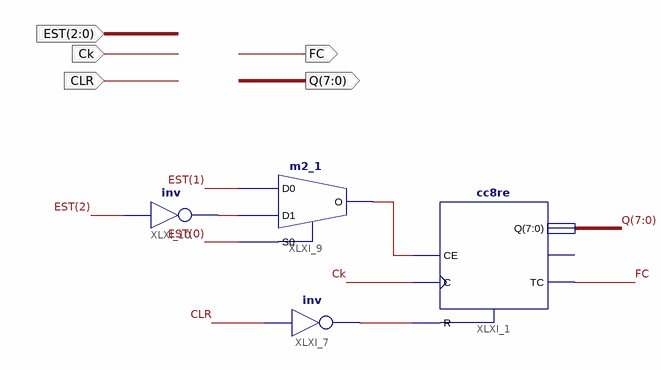
[diagram p0: schematic sheet 1]
// Xilinx ISE schematic Temp.sch (spartan6) as structural Verilog: 4 symbols, 5 ports
module Temp (
  input  CLR,
  input  Ck,
  input  [2:0] EST,
  output FC,
  output [7:0] Q
);

  wire XLXN_7, XLXN_18, XLXN_25;

  cc8re XLXI_1 (.C(Ck), .CE(XLXN_7), .R(XLXN_18), .Q(Q), .TC(FC));  // open: CEO
  not XLXI_7 (XLXN_18, CLR);
  m2_1 XLXI_9 (.D0(EST[1]), .D1(XLXN_25), .S0(EST[0]), .O(XLXN_7));
  not XLXI_10 (XLXN_25, EST[2]);
endmodule
